# Altium schematic sheet TOP.SchDoc
size A4; SheetNumber: 1; SheetTotal: 9
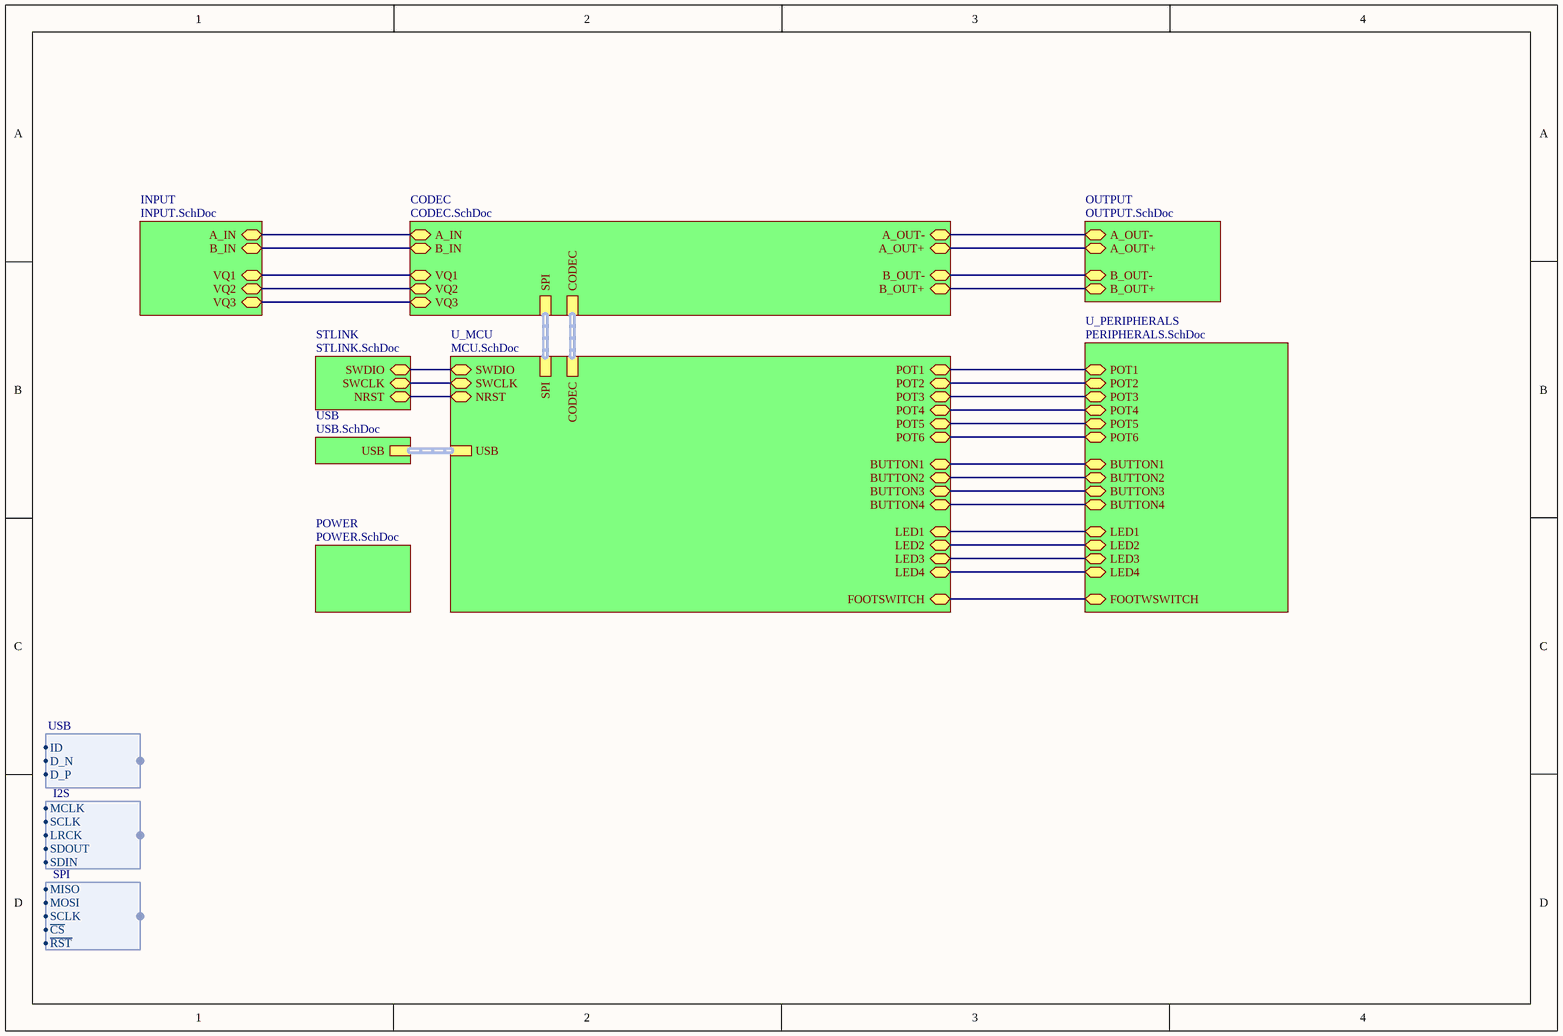
[diagram p0: TOP.SchDoc]

## Sub-sheets
CODEC = CODEC.SchDoc: CODEC (harness I2S), A_OUT- (bidir), A_OUT+ (bidir), B_OUT- (bidir), B_OUT+ (bidir), SPI (harness SPI), A_IN (bidir), B_IN (bidir), VQ1 (bidir), VQ2 (bidir), VQ3 (bidir)
INPUT = INPUT.SchDoc: VQ2 (bidir), VQ1 (bidir), VQ3 (bidir), A_IN (bidir), B_IN (bidir)
OUTPUT = OUTPUT.SchDoc: A_OUT- (bidir), A_OUT+ (bidir), B_OUT- (bidir), B_OUT+ (bidir)
POWER = POWER.SchDoc: no entries
STLINK = STLINK.SchDoc: SWDIO (bidir), SWCLK (bidir), NRST (bidir)
U_MCU = MCU.SchDoc: NRST (bidir), SWDIO (bidir), SWCLK (bidir), CODEC (harness I2S), SPI (harness SPI), POT1 (bidir), POT2 (bidir), POT3 (bidir), POT4 (bidir), POT5 (bidir), POT6 (bidir), BUTTON1 (bidir), BUTTON2 (bidir), BUTTON3 (bidir), BUTTON4 (bidir), LED1 (bidir), LED2 (bidir), LED3 (bidir), LED4 (bidir), FOOTSWITCH (bidir), USB (harness USB)
U_PERIPHERALS = PERIPHERALS.SchDoc: POT4 (bidir), POT5 (bidir), POT6 (bidir), POT1 (bidir), POT2 (bidir), POT3 (bidir), LED3 (bidir), LED1 (bidir), LED4 (bidir), LED2 (bidir), BUTTON1 (bidir), BUTTON3 (bidir), BUTTON2 (bidir), BUTTON4 (bidir), FOOTWSWITCH (bidir)
USB = USB.SchDoc: USB (harness USB)

## Harnesses
USB: D_P, D_N, ID
I2S: MCLK, SCLK, LRCK, SDOUT, SDIN
SPI: MISO, MOSI, SCLK, ~{CS}, ~{RST}

## Nets
(unnamed): sheet INPUT/VQ2, sheet CODEC/VQ2
(unnamed): sheet INPUT/VQ1, sheet CODEC/VQ1
(unnamed): sheet INPUT/VQ3, sheet CODEC/VQ3
(unnamed): sheet INPUT/A_IN, sheet CODEC/A_IN
(unnamed): sheet INPUT/B_IN, sheet CODEC/B_IN
(unnamed): sheet OUTPUT/A_OUT-, sheet CODEC/A_OUT-
(unnamed): sheet OUTPUT/A_OUT+, sheet CODEC/A_OUT+
(unnamed): sheet OUTPUT/B_OUT-, sheet CODEC/B_OUT-
(unnamed): sheet OUTPUT/B_OUT+, sheet CODEC/B_OUT+
(unnamed): sheet STLINK/SWDIO, sheet U_MCU/SWDIO
(unnamed): sheet STLINK/SWCLK, sheet U_MCU/SWCLK
(unnamed): sheet STLINK/NRST, sheet U_MCU/NRST
(unnamed): sheet U_MCU/POT1, sheet U_PERIPHERALS/POT1
(unnamed): sheet U_MCU/POT2, sheet U_PERIPHERALS/POT2
(unnamed): sheet U_MCU/POT3, sheet U_PERIPHERALS/POT3
(unnamed): sheet U_MCU/POT4, sheet U_PERIPHERALS/POT4
(unnamed): sheet U_MCU/POT5, sheet U_PERIPHERALS/POT5
(unnamed): sheet U_MCU/POT6, sheet U_PERIPHERALS/POT6
(unnamed): sheet U_MCU/BUTTON1, sheet U_PERIPHERALS/BUTTON1
(unnamed): sheet U_MCU/BUTTON2, sheet U_PERIPHERALS/BUTTON2
(unnamed): sheet U_MCU/BUTTON3, sheet U_PERIPHERALS/BUTTON3
(unnamed): sheet U_MCU/BUTTON4, sheet U_PERIPHERALS/BUTTON4
(unnamed): sheet U_MCU/LED1, sheet U_PERIPHERALS/LED1
(unnamed): sheet U_MCU/LED2, sheet U_PERIPHERALS/LED2
(unnamed): sheet U_MCU/LED3, sheet U_PERIPHERALS/LED3
(unnamed): sheet U_MCU/LED4, sheet U_PERIPHERALS/LED4
(unnamed): sheet U_MCU/FOOTSWITCH, sheet U_PERIPHERALS/FOOTWSWITCH

## Buses and harness runs
harness sheet CODEC/CODEC = sheet U_MCU/CODEC
harness sheet CODEC/SPI = sheet U_MCU/SPI
harness sheet U_MCU/USB = sheet USB/USB